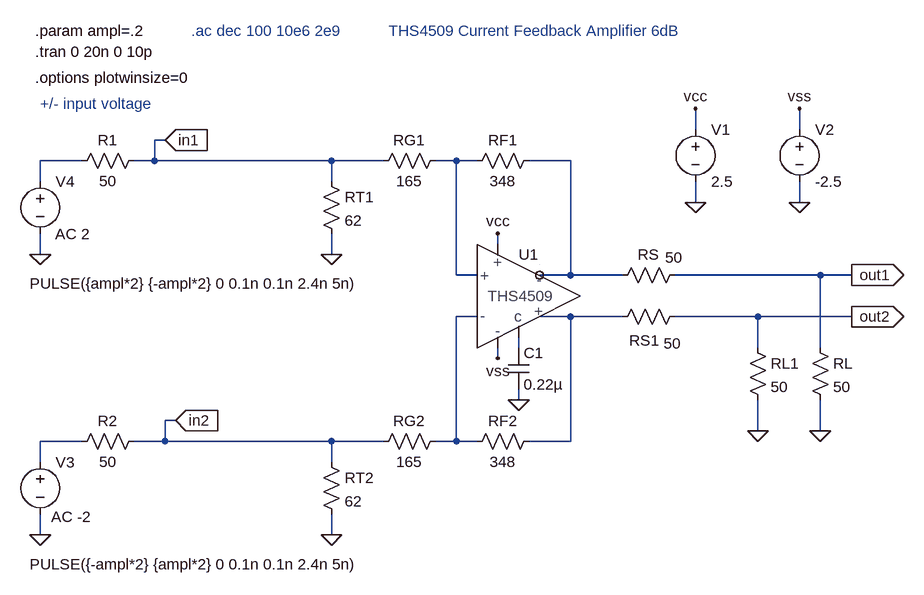
[diagram p0: schematic THS4509_test1.asc]
THS4509_test1.asc, the LTspice schematic file:
Version 4
SHEET 1 880 780
WIRE 368 -96 368 -128
WIRE 528 -96 528 -128
WIRE -448 -80 -464 -80
WIRE -576 -48 -640 -48
WIRE -464 -48 -464 -80
WIRE -464 -48 -496 -48
WIRE -192 -48 -464 -48
WIRE -112 -48 -192 -48
WIRE 0 -48 -32 -48
WIRE 32 -48 0 -48
WIRE 176 -48 112 -48
WIRE -640 -16 -640 -48
WIRE -192 -16 -192 -48
WIRE 368 16 368 -16
WIRE 528 16 528 -16
WIRE 64 80 64 64
WIRE -640 96 -640 64
WIRE -192 96 -192 64
WIRE 0 128 0 -48
WIRE 32 128 0 128
WIRE 176 128 176 -48
WIRE 176 128 128 128
WIRE 256 128 176 128
WIRE 560 128 336 128
WIRE 608 128 560 128
WIRE 32 192 0 192
WIRE 176 192 128 192
WIRE 256 192 176 192
WIRE 464 192 336 192
WIRE 608 192 464 192
WIRE 96 240 96 224
WIRE 464 240 464 192
WIRE 560 240 560 128
WIRE 64 256 64 240
WIRE 96 320 96 304
WIRE -432 352 -448 352
WIRE 464 368 464 320
WIRE 560 368 560 320
WIRE -576 384 -640 384
WIRE -448 384 -448 352
WIRE -448 384 -496 384
WIRE -192 384 -448 384
WIRE -112 384 -192 384
WIRE 0 384 0 192
WIRE 0 384 -32 384
WIRE 32 384 0 384
WIRE 176 384 176 192
WIRE 176 384 112 384
WIRE -640 416 -640 384
WIRE -192 416 -192 384
WIRE -640 528 -640 496
WIRE -192 528 -192 496
FLAG 368 16 0
FLAG 528 16 0
FLAG 368 -128 vcc
FLAG 528 -128 vss
FLAG 64 64 vcc
FLAG 64 256 vss
FLAG -192 528 0
FLAG -640 528 0
FLAG 560 368 0
FLAG 608 128 out1
IOPIN 608 128 Out
FLAG -432 352 in2
IOPIN -432 352 In
FLAG -192 96 0
FLAG -640 96 0
FLAG -448 -80 in1
IOPIN -448 -80 In
FLAG 464 368 0
FLAG 608 192 out2
IOPIN 608 192 Out
FLAG 96 320 0
SYMBOL voltage 368 -112 R0
SYMATTR InstName V1
SYMATTR Value 2.5
SYMBOL voltage 528 -112 R0
SYMATTR InstName V2
SYMATTR Value -2.5
SYMBOL res 16 -32 R270
WINDOW 0 32 56 VTop 0
WINDOW 3 0 56 VBottom 0
SYMATTR InstName RF1
SYMATTR Value 348
SYMBOL res -128 -32 R270
WINDOW 0 32 56 VTop 0
WINDOW 3 0 56 VBottom 0
SYMATTR InstName RG1
SYMATTR Value 165
SYMBOL res -208 400 R0
SYMATTR InstName RT2
SYMATTR Value 62
SYMBOL res -592 400 R270
WINDOW 0 32 56 VTop 0
WINDOW 3 0 56 VBottom 0
SYMATTR InstName R2
SYMATTR Value 50
SYMBOL voltage -640 400 R0
WINDOW 3 -16 173 Left 0
WINDOW 123 17 100 Left 0
WINDOW 39 0 0 Left 0
SYMATTR Value PULSE({-ampl*2} {ampl*2} 0 0.1n 0.1n 2.4n 5n)
SYMATTR Value2 AC -2
SYMATTR InstName V3
SYMBOL res 240 144 R270
WINDOW 0 32 56 VTop 0
WINDOW 3 59 95 VBottom 0
SYMATTR InstName RS
SYMATTR Value 50
SYMBOL res 544 224 R0
SYMATTR InstName RL
SYMATTR Value 50
SYMBOL res 16 400 R270
WINDOW 0 32 56 VTop 0
WINDOW 3 0 56 VBottom 0
SYMATTR InstName RF2
SYMATTR Value 348
SYMBOL res -128 400 R270
WINDOW 0 32 56 VTop 0
WINDOW 3 0 56 VBottom 0
SYMATTR InstName RG2
SYMATTR Value 165
SYMBOL res -208 -32 R0
SYMATTR InstName RT1
SYMATTR Value 62
SYMBOL res -592 -32 R270
WINDOW 0 32 56 VTop 0
WINDOW 3 0 56 VBottom 0
SYMATTR InstName R1
SYMATTR Value 50
SYMBOL voltage -640 -32 R0
WINDOW 3 -16 173 Left 0
WINDOW 123 23 97 Left 0
WINDOW 39 0 0 Left 0
SYMATTR Value PULSE({ampl*2} {-ampl*2} 0 0.1n 0.1n 2.4n 5n)
SYMATTR Value2 AC 2
SYMATTR InstName V4
SYMBOL res 240 208 R270
WINDOW 0 -36 49 VTop 0
WINDOW 3 -10 93 VBottom 0
SYMATTR InstName RS1
SYMATTR Value 50
SYMBOL res 448 224 R0
SYMATTR InstName RL1
SYMATTR Value 50
SYMBOL cap 80 240 R0
SYMATTR InstName C1
SYMATTR Value 0.22µ
SYMBOL THS4509 96 160 R0
SYMATTR InstName U1
TEXT -104 -248 Left 0 ;THS4509 Current Feedback Amplifier 6dB
TEXT -648 -216 Left 0 !.tran 0 20n 0 10p
TEXT -648 -176 Left 0 !.options plotwinsize=0
TEXT -648 -248 Left 0 !.param ampl=.2
TEXT -640 -136 Left 0 ;+/- input voltage
TEXT -408 -248 Left 0 ;.ac dec 100 10e6 2e9
CIRCLE Normal 128 112 128 112

The netlist it stands for:
* THS4509_test1.asc
V1 vcc 0 2.5
V2 vss 0 -2.5
RF1 N002 N003 348
RG1 in1 N002 165
RT2 in2 0 62
R2 N007 in2 50
V3 N007 0 PULSE({-ampl*2} {ampl*2} 0 0.1n 0.1n 2.4n 5n) AC -2
RS N003 out1 50
RL out1 0 50
RF2 N004 N005 348
RG2 in2 N004 165
RT1 in1 0 62
R1 N001 in1 50
V4 N001 0 PULSE({ampl*2} {-ampl*2} 0 0.1n 0.1n 2.4n 5n) AC 2
RS1 N005 out2 50
RL1 out2 0 50
C1 N006 0 0.22µ
XU1 N002 N004 vcc vss N003 N005 N006 THS4509  ; pins in+ in- vs+ vs- out- out+ cm
* THS4509 Current Feedback Amplifier 6dB
.tran 0 20n 0 10p
.options plotwinsize=0
.param ampl=.2
* +/- input voltage
* .ac dec 100 10e6 2e9
.lib THS4509.txt
.backanno
.end